# Altium schematic sheet Motor_Control_Board.SchDoc: Motor Control Board
size A4; DrawnBy: Samyar Sadat Akhavi; Revision: 1.0; SheetNumber: 1; SheetTotal: 5
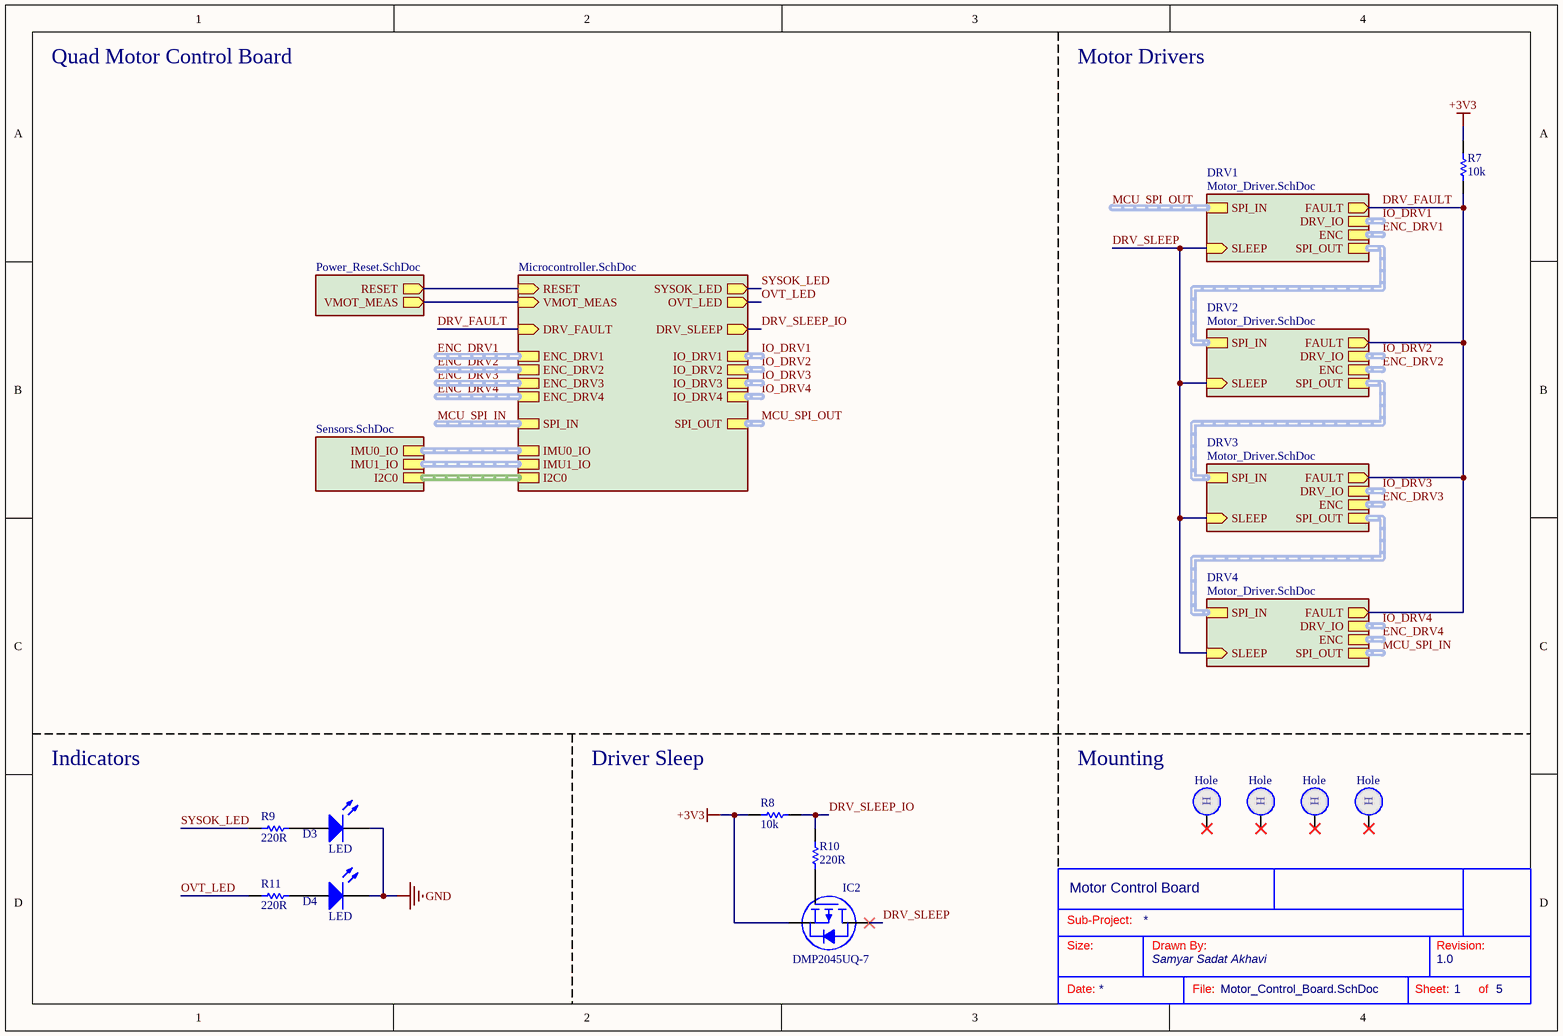
[diagram p0: Motor_Control_Board.SchDoc]

## Parts
?  (no value)  (graphical)
D3  LED  [LED_1206]
D4  LED  [LED_1206]
Hole1  Hole  [hole_2.6]  (no BOM)
Hole2  Hole  [hole_2.6]  (no BOM)
Hole3  Hole  [hole_2.6]  (no BOM)
Hole4  Hole  [hole_2.6]  (no BOM)
IC2  DMP2045UQ-7  [DIODES SOT-23-3]
R7  10k  [RES_0603]
R8  10k  [RES_0603]
R9  220R  [RES_0603]
R10  220R  [RES_0603]
R11  220R  [RES_0603]

## Sub-sheets
DRV1 = Motor_Driver.SchDoc: DRV_IO (harness Drive_IO), ENC (harness Encoder), SLEEP (in), SPI_IN (harness SPI_Uni), SPI_OUT (harness SPI_Uni), FAULT (out)
DRV2 = Motor_Driver.SchDoc: DRV_IO (harness Drive_IO), ENC (harness Encoder), SLEEP (in), SPI_IN (harness SPI_Uni), SPI_OUT (harness SPI_Uni), FAULT (out)
DRV3 = Motor_Driver.SchDoc: DRV_IO (harness Drive_IO), ENC (harness Encoder), SLEEP (in), SPI_IN (harness SPI_Uni), SPI_OUT (harness SPI_Uni), FAULT (out)
DRV4 = Motor_Driver.SchDoc: DRV_IO (harness Drive_IO), ENC (harness Encoder), SLEEP (in), SPI_IN (harness SPI_Uni), SPI_OUT (harness SPI_Uni), FAULT (out)
MCU = Microcontroller.SchDoc: RESET (in), DRV_SLEEP (out), OVT_LED (out), SYSOK_LED (out), VMOT_MEAS (in), ENC_DRV1 (harness Encoder), IO_DRV1 (harness Drive_IO), SPI_OUT (harness SPI_Uni), SPI_IN (harness SPI_Uni), ENC_DRV2 (harness Encoder), ENC_DRV3 (harness Encoder), ENC_DRV4 (harness Encoder), IO_DRV2 (harness Drive_IO), IO_DRV3 (harness Drive_IO), IO_DRV4 (harness Drive_IO), DRV_FAULT (in), I2C0 (harness I2C), IMU0_IO (harness IMU_IO), IMU1_IO (harness IMU_IO)
PWR = Power_Reset.SchDoc: RESET (out), VMOT_MEAS (out)
SENS = Sensors.SchDoc: I2C0 (harness I2C), IMU0_IO (harness IMU_IO), IMU1_IO (harness IMU_IO)

## Nets
+3V3: IC2.2(S) R7.1 R8.2
GND: D3.2(K) D4.2(K)
DRV_FAULT: R7.2 ; sheet DRV1/FAULT, sheet MCU/DRV_FAULT, sheet DRV2/FAULT, sheet DRV3/FAULT, sheet DRV4/FAULT
DRV_SLEEP: IC2.3(D) ; sheet DRV1/SLEEP, sheet DRV2/SLEEP, sheet DRV3/SLEEP, sheet DRV4/SLEEP
DRV_SLEEP_IO: R8.1 R10.2 ; sheet MCU/DRV_SLEEP
OVT_LED: R11.2 ; sheet MCU/OVT_LED
SYSOK_LED: R9.2 ; sheet MCU/SYSOK_LED
NetD3_1: D3.1(A) R9.1
NetD4_1: D4.1(A) R11.1
NetIC2_1: IC2.1(G) R10.1
(unnamed): sheet MCU/RESET, sheet PWR/RESET
(unnamed): sheet MCU/VMOT_MEAS, sheet PWR/VMOT_MEAS

Not connected (* = marked no-connect by the designer): Hole1 1*; Hole2 1*; Hole3 1*; Hole4 1*

## Buses and harness runs
harness ENC_DRV1 = sheet DRV1/ENC
harness ENC_DRV1 = sheet MCU/ENC_DRV1
harness ENC_DRV2 = sheet DRV2/ENC
harness ENC_DRV2 = sheet MCU/ENC_DRV2
harness ENC_DRV3 = sheet DRV3/ENC
harness ENC_DRV3 = sheet MCU/ENC_DRV3
harness ENC_DRV4 = sheet DRV4/ENC
harness ENC_DRV4 = sheet MCU/ENC_DRV4
harness IO_DRV1 = sheet DRV1/DRV_IO
harness IO_DRV1 = sheet MCU/IO_DRV1
harness IO_DRV2 = sheet DRV2/DRV_IO
harness IO_DRV2 = sheet MCU/IO_DRV2
harness IO_DRV3 = sheet DRV3/DRV_IO
harness IO_DRV3 = sheet MCU/IO_DRV3
harness IO_DRV4 = sheet DRV4/DRV_IO
harness IO_DRV4 = sheet MCU/IO_DRV4
harness MCU_SPI_IN = sheet DRV4/SPI_OUT
harness MCU_SPI_IN = sheet MCU/SPI_IN
harness MCU_SPI_OUT = sheet DRV1/SPI_IN
harness MCU_SPI_OUT = sheet MCU/SPI_OUT
harness sheet DRV1/SPI_OUT = sheet DRV2/SPI_IN
harness sheet DRV2/SPI_OUT = sheet DRV3/SPI_IN
harness sheet DRV3/SPI_OUT = sheet DRV4/SPI_IN
harness sheet MCU/I2C0 = sheet SENS/I2C0
harness sheet MCU/IMU0_IO = sheet SENS/IMU0_IO
harness sheet MCU/IMU1_IO = sheet SENS/IMU1_IO

## Notes on the sheet
- Quad Motor Control Board
- Motor Drivers
- Indicators
- Driver Sleep
- Mounting
- Sub-Project:
- Size:
- Drawn By:
- Revision:
- Date:
- File:
- Sheet:
- of
- (in symbol Hole) H

## Library data of the parts
? = Standard Title Block
D3 = LED: Indicator LED; Color: Green
D4 = LED: Indicator LED; Color: Amber
IC2 = DMP2045UQ-7: MOSFET P-CH 20V 4.3A SOT23; Manufacturer: Diodes Incorporated; Current - Continuous Drain (Id) @ 25°C: 4.3A (Ta); Drive Voltage (Max Rds On,  Min Rds On): 1.8V, 4.5V; FET Type: P-Channel; Gate Charge (Qg) (Max) @ Vgs: 6.8 nC @ 4.5 V; Input Capacitance (Ciss) (Max) @ Vds: 634 pF @ 10 V; Power Dissipation (Max): 800mW (Ta); Rds On (Max) @ Id, Vgs: 45mOhm @ 4A, 4.5V; Vgs (Max): ±8V; Vgs(th) (Max) @ Id: 1V @ 250µA; Part Number: DMP2045UQ-7; ComponentLink1Description: Datasheet; ComponentLink1URL: https://www.diodes.com/assets/Datasheets/DMP2045UQ.pdf; ComponentLink2Description: DigiKey Link; ComponentLink2URL: https://www.digikey.com/en/products/detail/diodes-incorporated/DMP2045UQ-7/10674156; Drain to Source Voltage (Vdss): 20 V; LastUpdated: 6/3/2024 8:15:19 PM; Lifecycle Status: Active; Minimum Order: 1; Mounting Type: Surface Mount; Operating Temperature: -55°C ~ 150°C (TJ); Package / Case: TO-236-3, SC-59, SOT-23-3; Packaging: TapeAndReel; Part Status: Active; Price: 0.08; Series: -; Supplier 1: DigiKey; Supplier Part Number 1: 31-DMP2045UQ-7CT-ND; Supplier Device Package: SOT-23-3; Technology: MOSFET (Metal Oxide)
R7-R11 = Resistor: Power: 1/8W
  R7 R8: Value: 10k
  R9-R11: Value: 220R